# Altium schematic sheet Power.SchDoc
size 297 x 210 mm
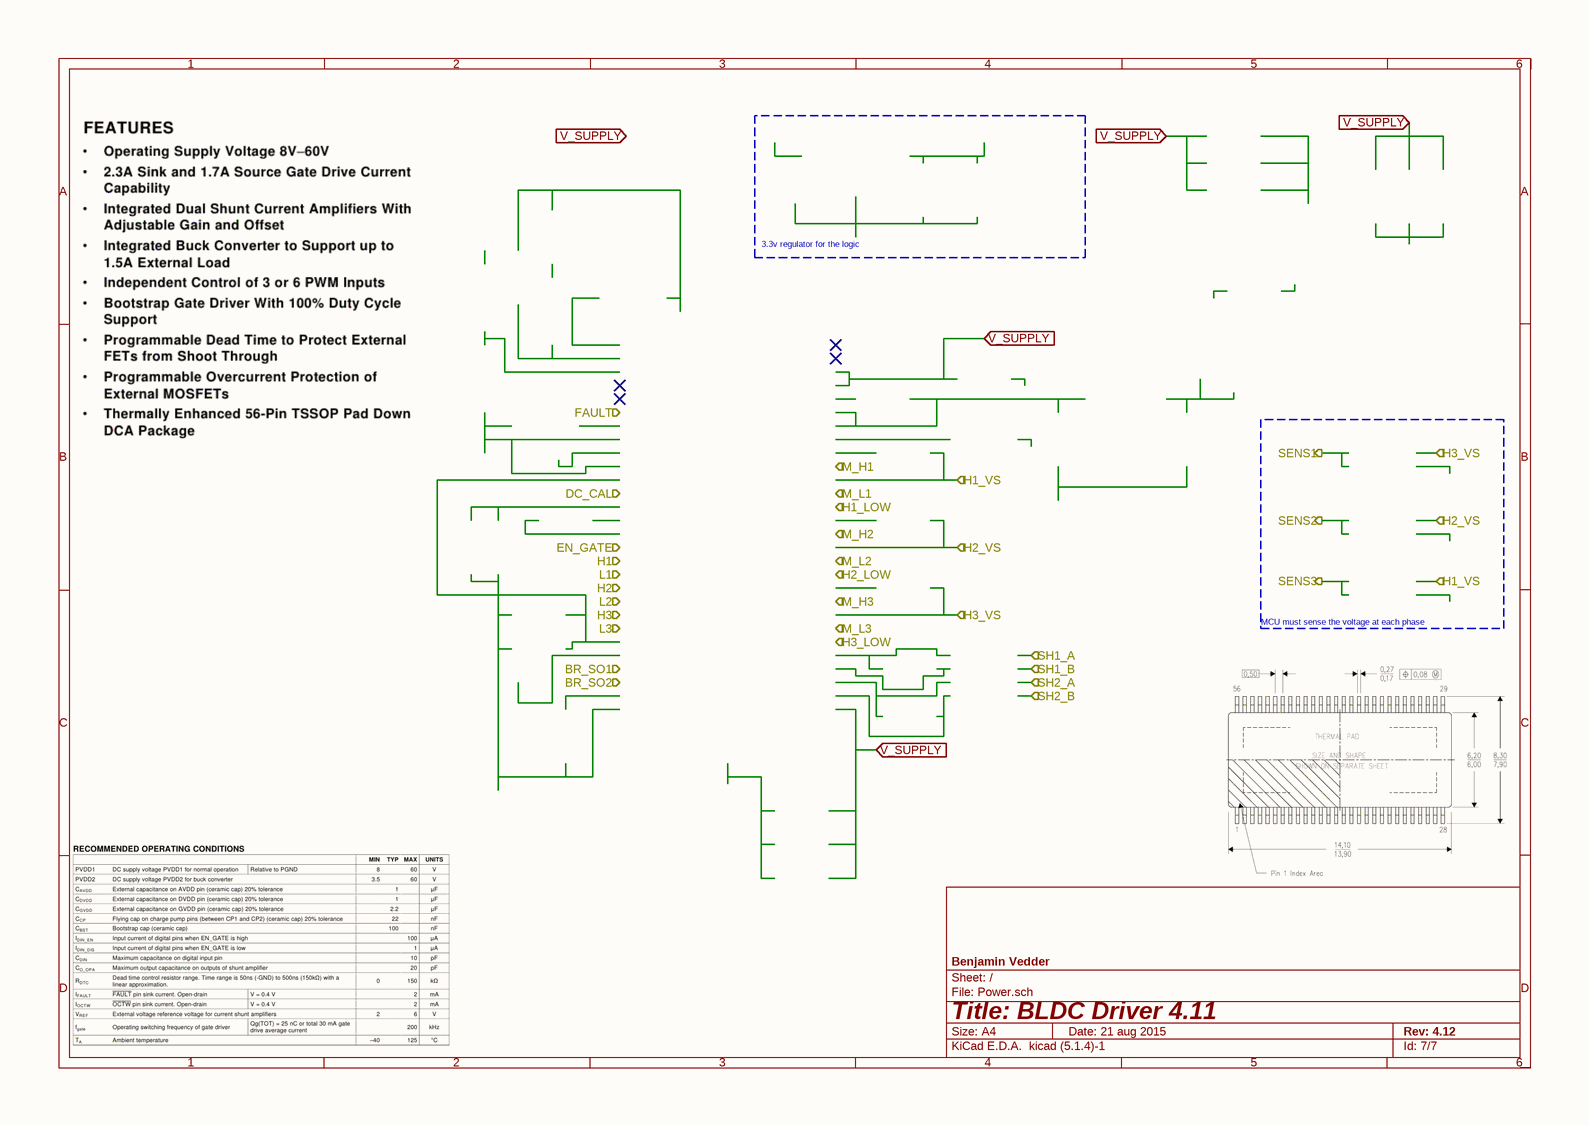
[diagram p0: Power.SchDoc]

## Ports
BR_SO1 (out), BR_SO2 (out), DC_CAL (in), EN_GATE (in), FAULT (out), H1 (in), H1_LOW (in), H1_VS (in), H2 (in), H2_LOW (in), H2_VS (in), H3 (in), H3_LOW (in), H3_VS (in), L1 (in), L2 (in), L3 (in), M_H1 (out), M_H2 (out), M_H3 (out), M_L1 (out), M_L2 (out), M_L3 (out), SENS1 (out), SENS2 (out), SENS3 (out), SH1_A (in), SH1_B (in), SH2_A (in), SH2_B (in), V_SUPPLY (in)

## Notes on the sheet
- 3.3v regulator
  for the logic
- MCU must sense the
  voltage at each phase
- 1
- 2
- 3
- 4
- 5
- 6
- A
- B
- C
- D
- Title: BLDC Driver 4.11
- File: Power.sch
- Sheet: /
- Benjamin Vedder
- KiCad E.D.A.  kicad (5.1.4)-1
- Size: A4
- Date: 21 aug 2015
- Rev: 4.12
- Id: 7/7